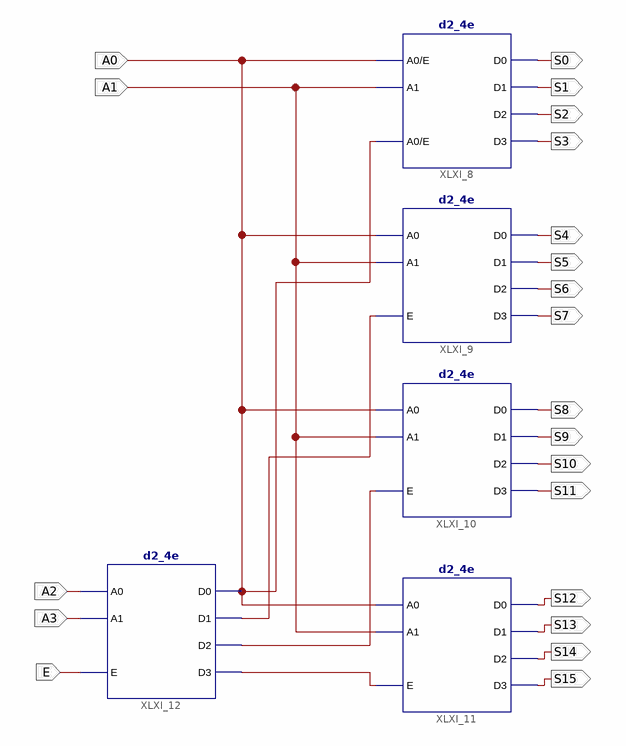
[diagram p0: schematic sheet 1]
// Xilinx ISE schematic decod4a16.sch (spartan3e) as structural Verilog: 5 symbols, 21 ports
module decod4a16 (
  input  A0,
  input  A1,
  input  E,
  input  A2,
  input  A3,
  output S0,
  output S1,
  output S2,
  output S3,
  output S4,
  output S5,
  output S6,
  output S7,
  output S8,
  output S9,
  output S10,
  output S11,
  output S15,
  output S14,
  output S13,
  output S12
);

  wire XLXN_17, XLXN_41, XLXN_42;

  d2_4e XLXI_9 (.A0(A0), .A1(A1), .E(XLXN_42), .D0(S4), .D1(S5), .D2(S6), .D3(S7));
  d2_4e XLXI_10 (.A0(A0), .A1(A1), .E(XLXN_41), .D0(S8), .D1(S9), .D2(S10), .D3(S11));
  d2_4e XLXI_8 (.A0(A0), .A1(A1), .E(A0), .D0(S0), .D1(S1), .D2(S2), .D3(S3));
  d2_4e XLXI_12 (.A0(A2), .A1(A3), .E(E), .D0(A0), .D1(XLXN_42), .D2(XLXN_41), .D3(XLXN_17));
  d2_4e XLXI_11 (.A0(A0), .A1(A1), .E(XLXN_17), .D0(S12), .D1(S13), .D2(S14), .D3(S15));
endmodule
